# EAGLE design Drobitminiconnector (EAGLE 7.5.0)
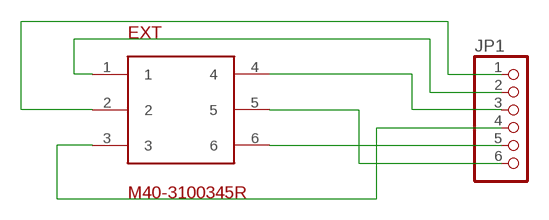
[diagram p0: schematic, sheet 1]

## Parts
EXT  M40-3100345R  [M40-3100345R]
JP1  PINHD-1X6  [1X06]

## Nets
N$1: EXT.2 JP1.1
N$2: EXT.1 JP1.2
N$3: EXT.4 JP1.3
N$4: EXT.3 JP1.4
N$5: EXT.6 JP1.5
N$6: EXT.5 JP1.6

## Library data of the parts
EXT = droning-passives:M40-3100345R
JP1 = adafruit:PINHD-1X6: PIN HEADER

## Board
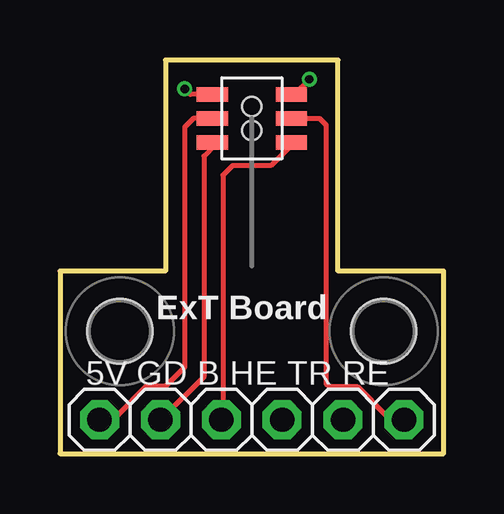
[diagram p1: board, top side]
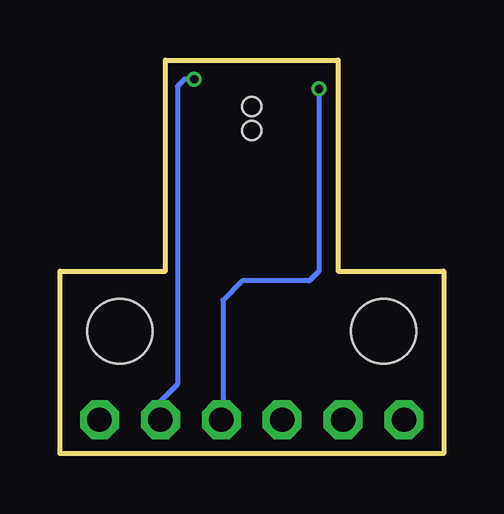
[diagram p2: board, bottom side, seen from below]

Size 16 x 16.4 mm. Coordinates in mm from the lower left corner, seen from the top.
Outline: 4.4,16.4 4.4,7.6 0,7.6 0,0 16,0 16,7.6 11.6,7.6 11.6,16.4 4.4,16.4
Copper layers (1*16): Top 0.035mm / dielectric 1.55mm / Bottom 0.035mm
Design rules "EU_35um_DRONING": minimum track width 0.2mm, minimum drill 0.35mm, track to track 0.175mm, track to pad 0.175mm, pad to pad 0.175mm, via to via 0.175mm, smd to smd 0mil, copper to edge 0.25mm, drill to drill 0.35mm, minimum pad ring 0.175mm, minimum via ring 0.125mm, stop-mask expansion 0mil, vias tented up to drill 2mm, thermal gap 0.2mm
Holes 2.7 mm at 13.5,5.1 2.5,5.1

### Footprints (pad centres in the part's own frame; a part is rotated, then mirrored left to right if it is on the bottom)
M40-3100345R = smd 0.6 x 1.3: 1 -1,1.65; 2 0,1.65; 3 1,1.65; 4 -1,-1.65; 5 0,-1.65; 6 1,-1.65 | hole 0.8: -0.5,0; 0.5,0
1X06 = drill 1.016 octagon: 1 -6.35,0; 2 -3.81,0; 3 -1.27,0; 4 1.27,0; 5 3.81,0; 6 6.35,0

### Placement (x,y rotation side)
EXT  8,13.97 90 top
JP1  8,1.41 0 top

### Tracks (layer width: path | path; a pad name or v marks a point on that pad's centre or on a via)
N$1
  Top 0.2: EXT.2 5.57,13.97 5.2,13.6 5.2,3.6 4.4,2.8 3.6,2.8 2.4,1.6 1.84,1.6 JP1.1 1.6,1.46
N$2
  Top 0.2: EXT.1 6.44,12.84 6,12.4 6,3.2 5.2,2.4 5.18,2.4 JP1.2
N$3
  Top 0.2: EXT.4 9.74,12.94 8.8,12 7.2,12 6.8,11.6 6.8,1.48 JP1.3
N$4  (via drill 0.35)
  Top 0.2: EXT.3 5.43,14.97 v5.2,15.2
  Bottom 0.2: v5.2,15.2 5.2,7.6 5.6,7.2 8.4,7.2 9.2,6.4 9.2,1.48 JP1.4
N$5  (via drill 0.35)
  Top 0.2: EXT.6 9.77,14.97 v10.4,15.6
  Bottom 0.2: v10.4,15.6 10.8,15.6 11.1,15.3 11.1,2.9 12,2 12,1.6 JP1.5
N$6
  Top 0.2: EXT.5 10.83,13.97 11.1,13.7 11.1,2.9 11.2,2.8 12.4,2.8 13.6,1.6 14.16,1.6 JP1.6 14.4,1.46

### Text on the board
tNames: ExT Board | 5V GD B HE TR RE